# Altium schematic sheet Sheet_1_2021-07-19.schdoc
size 191 x 87 mm
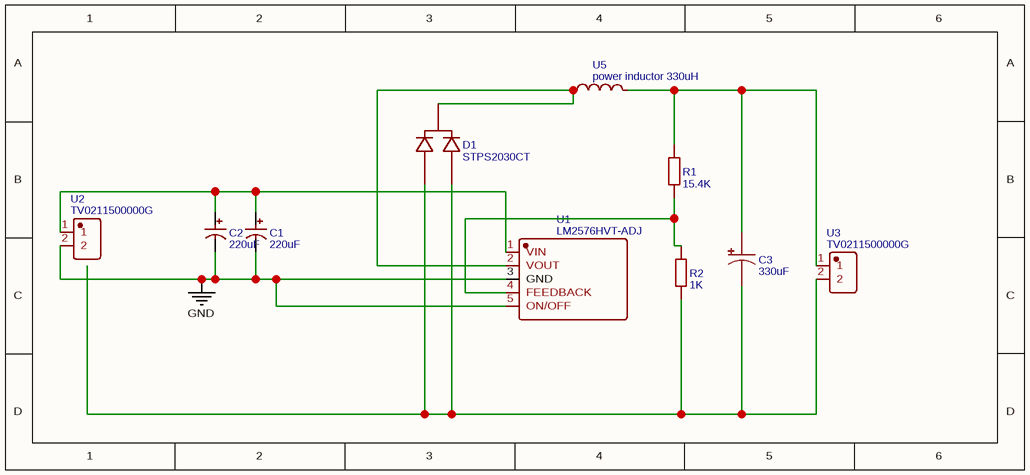
[diagram p0: Sheet_1_2021-07-19.schdoc]

## Parts
C1  220uF  [CAP-TH_BD12.5-P5.00-D1.2-FD]
C2  220uF  [CAP-TH_BD12.5-P5.00-D1.2-FD]
C3  330uF  [CAP-TH_BD16.0-P7.50-D1.2-FD]
D1  STPS2030CT  [TO-220AB-3_L10.4-W4.6-P2.54-T]
R1  15.4K  [R1206]
R2  1K  [R1206]
U1  LM2576HVT-ADJ  [TO-220-5L_L10.2-W4.5-P1.71-L]
U2  TV0211500000G  [CONN-TH_TV0211500000G]
U3  TV0211500000G  [CONN-TH_TV0211500000G]
U5  power inductor 330uH  [WURTH 330UH]

## Nets
GND: C1.2 C2.2 U1.3(GND) U1.5(ON/OFF) U2.2
NetC1_1: C1.1 C2.1 U1.1(VIN) U2.1
NetC3_1: C3.1 R1.1 U3.1 U5.2
NetC3_2: C3.2 D1.1(A1) D1.3(A2) R2.2 U3.2
NetD1_2: D1.2(K) U1.2(VOUT) U5.1
NetR1_2: R1.2 R2.1 U1.4(FEEDBACK)

## Library data of the parts
C1 C2 = 220uF: BOM_Manufacturer: CapXon; BOM_Manufacturer Part: KM221M100I200A; nameAlias: Capacitance; BOM_Supplier: LCSC; BOM_Supplier Part: C59392; spicePre: C; spiceSymbolName: KM221M100I200A
C3 = 330uF: BOM_Manufacturer: Aihua Group; BOM_Manufacturer Part: ERF1KM331L20OT; nameAlias: Capacitance; Contributor: LCSC; BOM_Supplier: LCSC; BOM_Supplier Part: C116510; spicePre: C; spiceSymbolName: ERF1KM331L20OT
D1 = STPS2030CT: BOM_Manufacturer: STMicroelectronics; Contributor: LCSC; BOM_Supplier Part: C171654; BOM_Supplier: LCSC; BOM_Manufacturer Part: STPS2030CT; spicePre: D; spiceSymbolName: STPS2030CT
R1 = 15.4K: BOM_Manufacturer: RALEC; BOM_Manufacturer Part: RTT061542FTP; nameAlias: Resistance (Ohms); Contributor: LCSC; BOM_Supplier: LCSC; BOM_Supplier Part: C246639; spicePre: R; spiceSymbolName: RTT061542FTP
R2 = 1K: BOM_Manufacturer: ResistorToday; BOM_Manufacturer Part: AECR1206F1K00K9; nameAlias: Resistance (Ohms); Contributor: LCSC; BOM_Supplier: LCSC; BOM_Supplier Part: C328410; spicePre: R; spiceSymbolName: AECR1206F1K00K9
U1 = LM2576HVT-ADJ: BOM_Manufacturer: HTC; Contributor: LCSC; SMT Type: Extend; BOM_Paste Type: expand; BOM_Supplier: LCSC; BOM_Manufacturer Part: LM2576HVT-ADJ; BOM_Supplier Part: C126041; BOM_LCSC Assembly: Yes; spicePre: U; spiceSymbolName: LM2576HVT-ADJ
U2 U3 = TV0211500000G: BOM_Manufacturer: Amphenol; Contributor: LCSC; BOM_Supplier: LCSC; BOM_Supplier Part: C2683163; BOM_Manufacturer Part: TV0211500000G; spicePre: U; spiceSymbolName: TV0211500000G
U5 = power inductor 330uH: BOM_Manufacturer: 74437529203331; Contributor: abdin.tesla; BOM_Manufacturer Part: 74437529203331; BOM_Supplier: Mouser; BOM_Supplier Part: 710-74437529203331; link: https://www.mouser.com/datasheet/2/445/74437529203331-1721976.pdf; spicePre: U; spiceSymbolName: power inductor 330uH